# EAGLE design Klasmata (EAGLE 9.6.2)
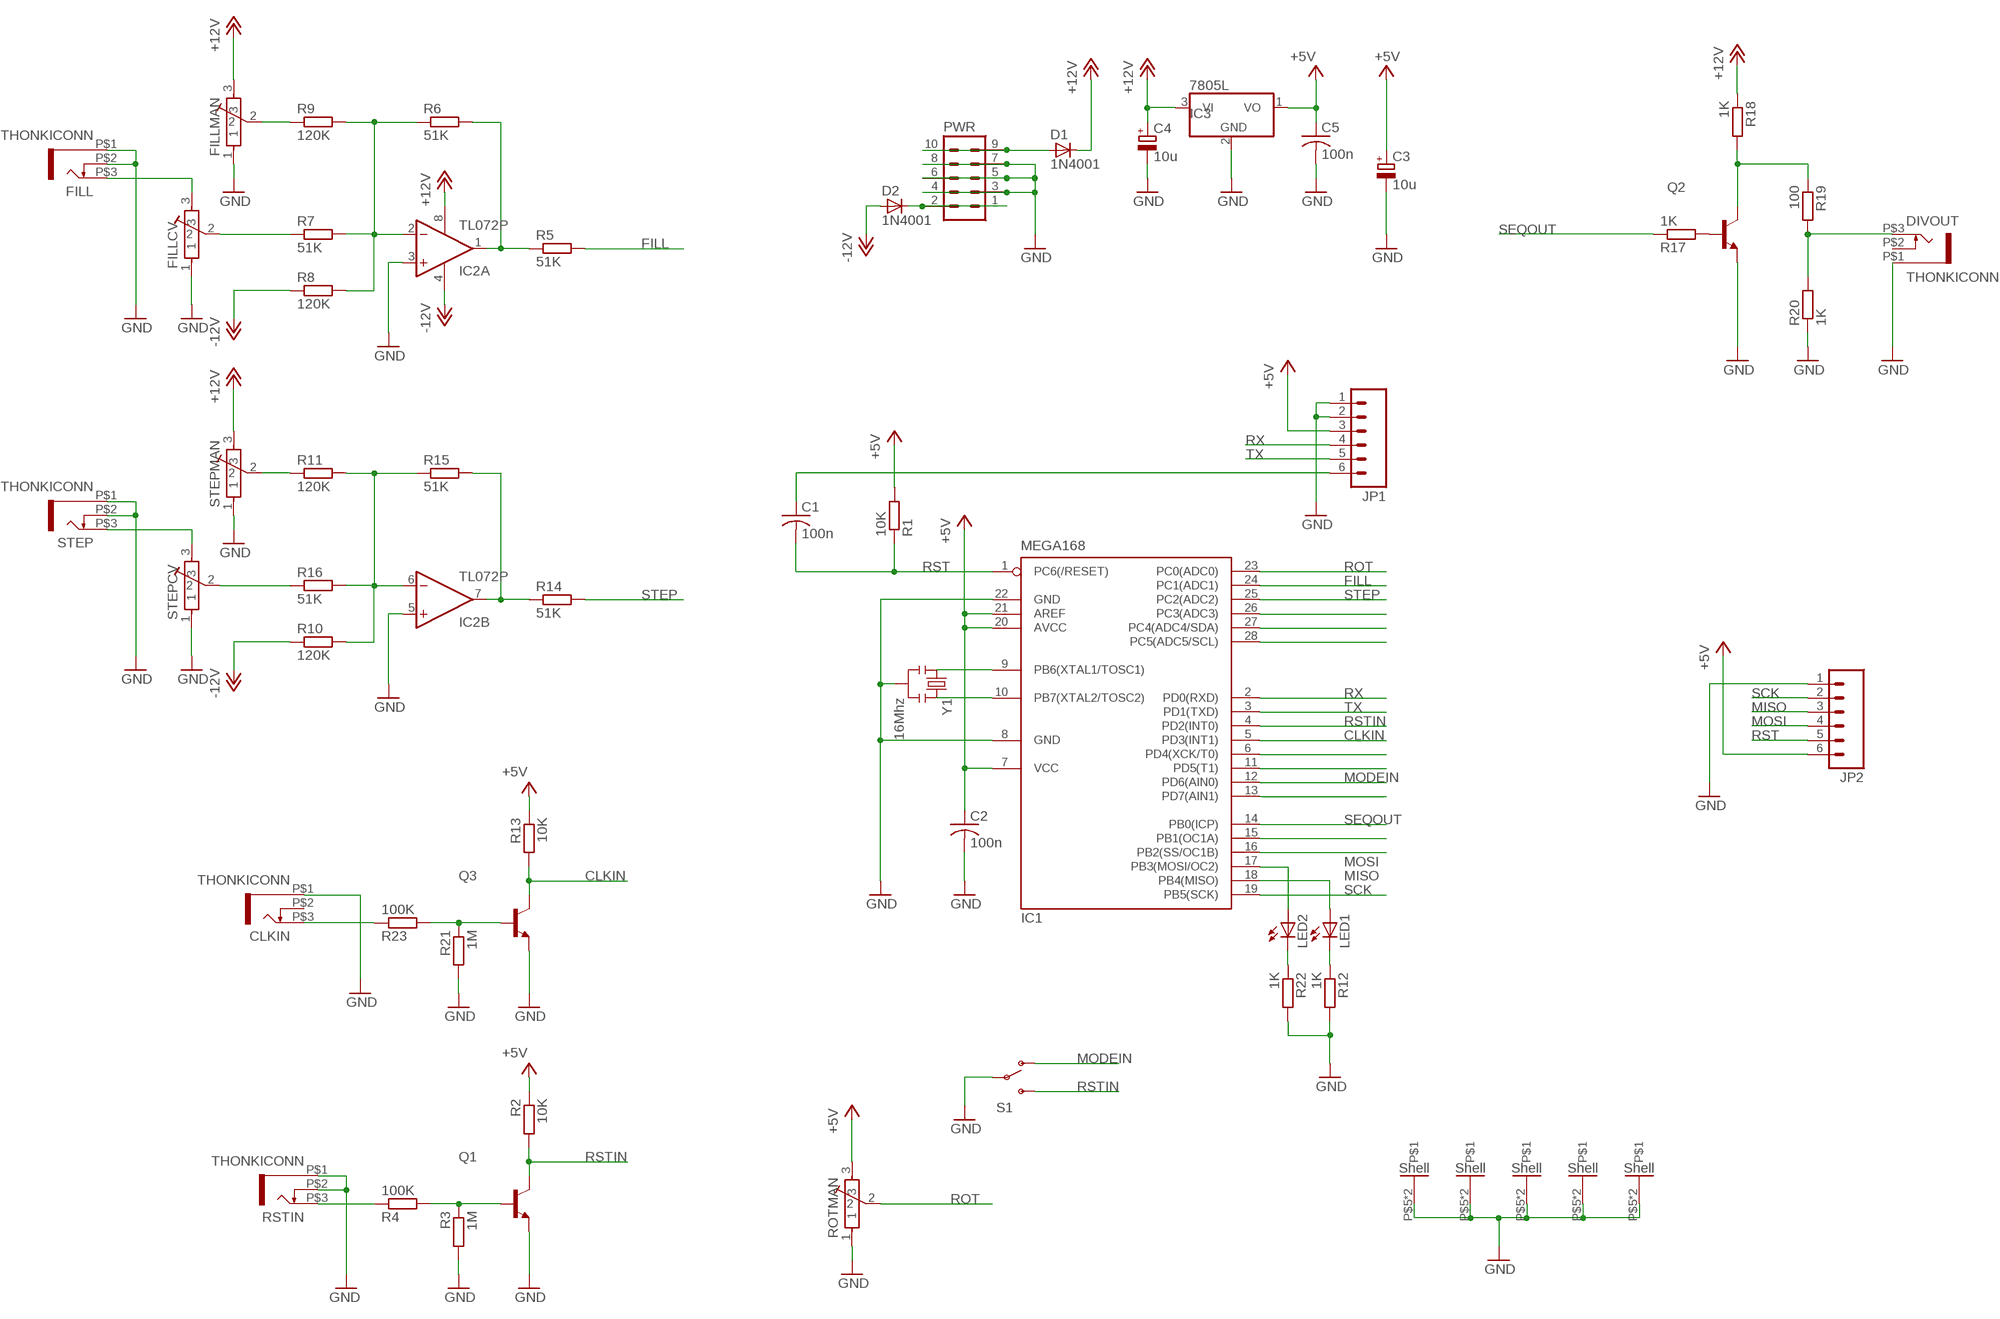
[diagram p0: schematic, sheet 1]

## Parts
C1  100n  C-US050-024X044  [C050-024X044]
C2  100n  C-US050-024X044  [C050-024X044]
C3  10u  CPOL-EUE2.5-6  [E2,5-6]
C4  10u  CPOL-EUE5-6  [E5-6]
C5  100n  C-US050-024X044  [C050-024X044]
CLKIN  THONKICONN  [THONKICONN]
D1  1N4001  DIODE1N4001  [DIODE-1N4001]
D2  1N4001  DIODE1N4001  [DIODE-1N4001]
DIVOUT  THONKICONN  [THONKICONN]
FILL  THONKICONN  [THONKICONN]
FILLCV  POT-ALPS-RK09L1140  [POT-ALPS-RK09L1140]
FILLMAN  POT-ALPS-RK09L1140  [POT-ALPS-RK09L1140]
IC1  MEGA168  MEGA8-P  [DIL28-3]
IC2  TL072P  [DIL08]
IC3  7805L  [TO92]
JP1  M06SIP  [1X06]
JP2  M06SIP  [1X06]
LED1  LED3MM  [LED3MM]
LED2  LED3MM  [LED3MM]
PWR  MA05-2  [MA05-2]
Q1  2N3904-NPN-TO92-EBC  [TO92-EBC]
Q2  2N3904-NPN-TO92-EBC  [TO92-EBC]
Q3  2N3904-NPN-TO92-EBC  [TO92-EBC]
R1  10K  R-EU_0204/7  [0204/7]
R2  10K  R-EU_0204/7  [0204/7]
R3  1M  R-EU_0204/7  [0204/7]
R4  100K  R-EU_0204/7  [0204/7]
R5  51K  R-EU_0204/7  [0204/7]
R6  51K  R-EU_0204/7  [0204/7]
R7  51K  R-EU_0204/7  [0204/7]
R8  120K  R-EU_0204/7  [0204/7]
R9  120K  R-EU_0204/7  [0204/7]
R10  120K  R-EU_0204/7  [0204/7]
R11  120K  R-EU_0204/7  [0204/7]
R12  1K  R-EU_0204/7  [0204/7]
R13  10K  R-EU_0204/7  [0204/7]
R14  51K  R-EU_0204/7  [0204/7]
R15  51K  R-EU_0204/7  [0204/7]
R16  51K  R-EU_0204/7  [0204/7]
R17  1K  R-EU_0204/7  [0204/7]
R18  1K  R-EU_0204/7  [0204/7]
R19  100  R-EU_0204/7  [0204/7]
R20  1K  R-EU_0204/7  [0204/7]
R21  1M  R-EU_0204/7  [0204/7]
R22  1K  R-EU_0204/7  [0204/7]
R23  100K  R-EU_0204/7  [0204/7]
ROTMAN  POT-ALPS-RK09L1140  [POT-ALPS-RK09L1140]
RSTIN  THONKICONN  [THONKICONN]
S1  SWITCH-SPST  [SWITCH-SPDT-SALECOM-T8014]
STEP  THONKICONN  [THONKICONN]
STEPCV  POT-ALPS-RK09L1140  [POT-ALPS-RK09L1140]
STEPMAN  POT-ALPS-RK09L1140  [POT-ALPS-RK09L1140]
Y1  16Mhz  RESONATORPTH  [RESONATOR-PTH]

## Nets
+5V: C2.1 C3.+ C5.1 IC1.7(VCC) IC1.20(AVCC) IC1.21(AREF) IC3.1(VO) JP1.3 JP2.6 R1.2 R2.1 R13.1 ROTMAN.3
+12V: C4.+ D1.C FILLMAN.3 IC2.8(P:V+) IC3.3(VI) R18.1 STEPMAN.3
-12V: D2.A IC2.4(P:V-) R8.1 R10.1
ALT: IC1.11(PD5(T1))
CLKIN: IC1.5(PD3(INT1)) Q3.C R13.2
CMBOUT: IC1.16(PB2(SS/OC1B))
DELOUT: IC1.15(PB1(OC1A))
FILL: IC1.24(PC1(ADC1)) R5.2
GND: C2.2 C3.- C4.- C5.2 CLKIN.P$1 DIVOUT.P$1 FILL.P$1 FILL.P$2 FILLCV.1 FILLCV.P$5 FILLCV.P$6 FILLMAN.1 FILLMAN.P$5 FILLMAN.P$6 IC1.8(GND) IC1.22(GND) IC2.3(A:+IN) IC2.5(B:+IN) IC3.2(GND) JP1.1 JP1.2 JP2.1 PWR.3 PWR.4 PWR.5 PWR.6 PWR.7 PWR.8 Q1.E Q2.E Q3.E R3.2 R12.2 R20.1 R21.2 R22.2 ROTMAN.1 ROTMAN.P$5 ROTMAN.P$6 RSTIN.P$1 RSTIN.P$2 S1.2(P) STEP.P$1 STEP.P$2 STEPCV.1 STEPCV.P$5 STEPCV.P$6 STEPMAN.1 STEPMAN.P$5 STEPMAN.P$6 Y1.2
MISO: IC1.18(PB4(MISO)) JP2.3 LED1.A
MODEB: IC1.13(PD7(AIN1))
MODEIN: IC1.12(PD6(AIN0)) S1.1(O)
MOSI: IC1.17(PB3(MOSI/OC2)) JP2.4 LED2.A
N$1: FILL.P$3 FILLCV.3
N$2: IC2.2(A:-IN) R6.1 R7.2 R8.2 R9.2
N$3: FILLMAN.2 R9.1
N$4: IC2.1(A:OUT) R5.1 R6.2
N$5: FILLCV.2 R7.1
N$6: D1.A PWR.9 PWR.10
N$7: IC2.6(B:-IN) R10.2 R11.2 R15.1 R16.2
N$8: R11.1 STEPMAN.2
N$9: IC2.7(B:OUT) R14.1 R15.2
N$10: R16.1 STEPCV.2
N$12: STEP.P$3 STEPCV.3
N$15: IC1.26(PC3(ADC3))
N$16: IC1.27(PC4(ADC4/SDA))
N$17: IC1.28(PC5(ADC5/SCL))
N$20: IC1.9(PB6(XTAL1/TOSC1)) Y1.1
N$21: IC1.10(PB7(XTAL2/TOSC2)) Y1.3
N$23: LED2.K(C) R22.1
N$24: LED1.K(C) R12.1
N$27: Q3.B R21.1 R23.2
N$28: CLKIN.P$3 R23.1
N$29: C1.1 JP1.6
N$31: Q1.B R3.1 R4.2
N$33: Q2.B R17.2
N$36: DIVOUT.P$3 R19.2 R20.2
N$37: Q2.C R18.2 R19.1
N$40: R4.1 RSTIN.P$3
N$42: D2.C PWR.1 PWR.2
ROT: IC1.23(PC0(ADC0)) ROTMAN.2
RST: C1.2 IC1.1(PC6(/RESET)) JP2.5 R1.1
RSTIN: IC1.4(PD2(INT0)) Q1.C R2.2 S1.3(S)
RX: IC1.2(PD0(RXD)) JP1.4
SCK: IC1.19(PB5(SCK)) JP2.2
SEQOUT: IC1.14(PB0(ICP)) R17.1
STEP: IC1.25(PC2(ADC2)) R14.2
TRIG: IC1.6(PD4(XCK/T0))
TX: IC1.3(PD1(TXD)) JP1.5
Unconnected: CLKIN.P$2 DIVOUT.P$2

## Library data of the parts
C1 C2 C5 = rcl:C-US: CAPACITOR, American symbol
C3 = resistor:CPOL-EU: POLARIZED CAPACITOR, European symbol
C4 = rcl:CPOL-EU: POLARIZED CAPACITOR, European symbol
CLKIN DIVOUT FILL RSTIN STEP = Rebel:THONKICONN
D1 D2 = Rebel:DIODE: Diode
FILLCV FILLMAN ROTMAN STEPCV STEPMAN = Rebel:POT-ALPS-RK09L
IC1 = atmel:MEGA8-P: MICROCONTROLLER 8 Kbytes FLASH, 1 kbytes SRAM, 512 bytes EEPROM, USART, 4-channel 10 bit ADC, 2-channel 8 bit ADC Pin compatible with Atmega48, ATMega88, ATMega168 Source: avr.lbr; OC_FARNELL: unknown; OC_NEWARK: unknown
IC2 = linear:TL072: OP AMP
IC3 = linear:78*: Positive VOLTAGE REGULATOR Source: http://cache.national.com/ds/LM/LM78L05.pdf http://www.fairchildsemi.com/ds/LM/LM7805.pdf
JP1 JP2 = SparkFun:M06: Header 6 Standard 6-pin 0.1" header. Use with straight break away headers (SKU : PRT-00116), right angle break away headers (PRT-00553), swiss pins (PRT-00743), machine pins (PRT-00117), and female headers (PRT-00115). Molex polarized connector foot print use with SKU : PRT-08094 with associated crimp pins and housings. NOTES ON THE VARIANTS LOCK and LOCK_LONGPADS... This footprint was designed to help hold the alignment of a through-hole component (i.e. 6-pin header) while soldering it into place. You may notice that each hole has been shifted either up or down by 0.005 of an inch from it's more standard position (which is a perfectly straight line). This slight alteration caused the pins (the squares in the middle) to touch the edges of the holes. Because they are alternating, it causes a "brace" to hold the component in place. 0.005 has proven to be the perfect amount of "off-center" position when using our standard breakaway headers. Although looks a little odd when you look at the bare footprint, once you have a header in there, the alteration is very hard to notice. Also, if you push a header all the way into place, it is covered up entirely on the bottom side. This idea of altering the position of holes to aid alignment will be further integrated into the Sparkfun Library for other footprints. It can help hold any component with 3 or more connection pins.
LED1 LED2 = Rebel:LED: LED OSRAM: - CHIPLED LG R971, LG N971, LY N971, LG Q971, LY Q971, LO R971, LY R971 LH N974, LH R974 LS Q976, LO Q976, LY Q976 LO Q996 - Hyper CHIPLED LW Q18S LB Q993, LB Q99A, LB R99A - SideLED LS A670, LO A670, LY A670, LG A670, LP A670 LB A673, LV A673, LT A673, LW A673 LH A674 LY A675 LS A676, LA A676, LO A676, LY A676, LW A676 LS A679, LY A679, LG A679 - Hyper Micro SIDELED® LS Y876, LA Y876, LO Y876, LY Y876 LT Y87S - SmartLED LW L88C, LW L88S LB L89C, LB L89S, LG L890 LS L89K, LO L89K, LY L89K LS L896, LA L896, LO L896, LY L896 - TOPLED LS T670, LO T670, LY T670, LG T670, LP T670 LSG T670, LSP T670, LSY T670, LOP T670, LYG T670 LG T671, LOG T671, LSG T671 LB T673, LV T673, LT T673, LW T673 LH T674 LS T676, LA T676, LO T676, LY T676, LB T676, LH T676, LSB T676, LW T676 LB T67C, LV T67C, LT T67C, LS T67K, LO T67K, LY T67K, LW E67C LS E67B, LA E67B, LO E67B, LY E67B, LB E67C, LV E67C, LT E67C LW T67C LS T679, LY T679, LG T679 LS T770, LO T770, LY T770, LG T770, LP T770 LB T773, LV T773, LT T773, LW T773 LH T774 LS E675, LA E675, LY E675, LS T675 LS T776, LA T776, LO T776, LY T776, LB T776 LHGB T686 LT T68C, LB T68C - Hyper Mini TOPLED® LB M676 - Mini TOPLED Santana® LG M470 LS M47K, LO M47K, LY M47K Source: http://www.osram.convergy.de LUXEON: - LUMILED® LXK2-PW12-R00, LXK2-PW12-S00, LXK2-PW14-U00, LXK2-PW14-V00 LXK2-PM12-R00, LXK2-PM12-S00, LXK2-PM14-U00 LXK2-PE12-Q00, LXK2-PE12-R00, LXK2-PE12-S00, LXK2-PE14-T00, LXK2-PE14-U00 LXK2-PB12-K00, LXK2-PB12-L00, LXK2-PB12-M00, LXK2-PB14-N00, LXK2-PB14-P00, LXK2-PB14-Q00 LXK2-PR12-L00, LXK2-PR12-M00, LXK2-PR14-Q00, LXK2-PR14-R00 LXK2-PD12-Q00, LXK2-PD12-R00, LXK2-PD12-S00 LXK2-PH12-R00, LXK2-PH12-S00 LXK2-PL12-P00, LXK2-PL12-Q00, LXK2-PL12-R00 Source: www.luxeon.com KINGBRIGHT: KA-3528ASYC Source: www.kingbright.com
PWR = Rebel:MA05-2: PIN HEADER; OC_FARNELL: unknown; OC_NEWARK: unknown
Q1-Q3 = transistor-neu-to92:*-NPN-: NPN Transistror
R1-R23 = Rebel:R-EU_: RESISTOR, European symbol
S1 = Rebel:SWITCH-SPST: SPST Switch Simple slide switch. Spark Fun Electronics SKU : COM-00102
Y1 = SparkFun:RESONATOR: Resonator Small SMD resonator. This is the itty bitty 10/20MHz resonators with built in caps. CSTCE10M0G55 and CSTCE20M0V53. Footprint has been reviewed closely but hasn't been tested yet.

## Board
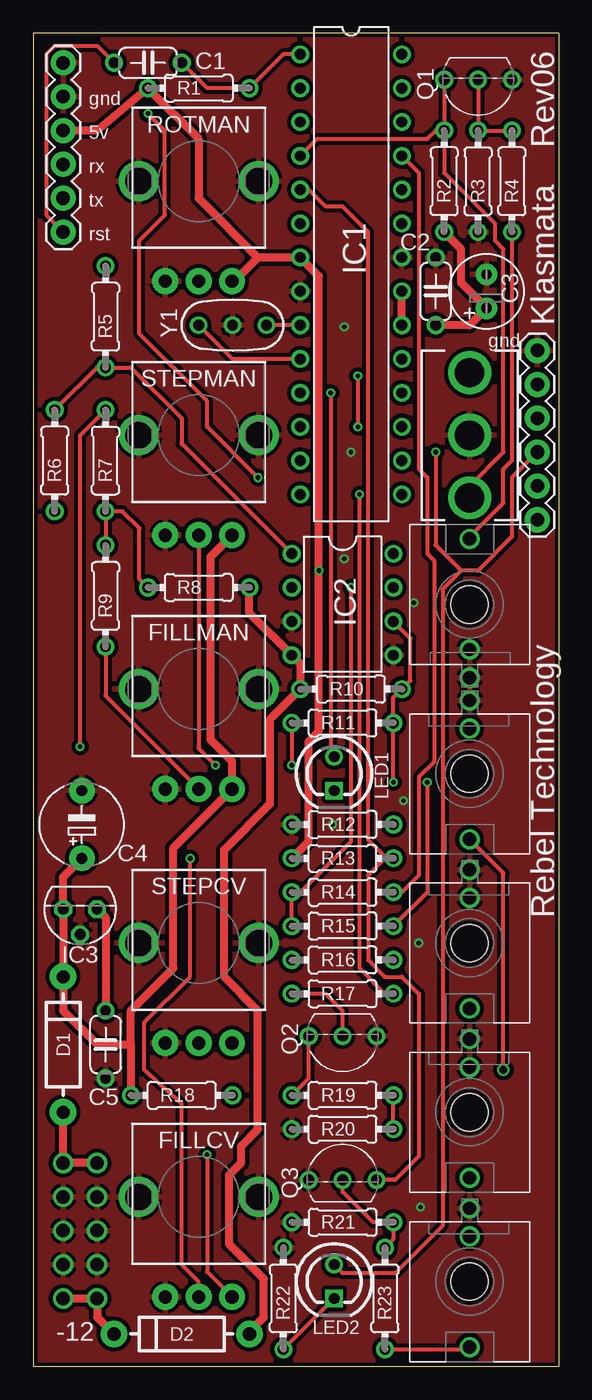
[diagram p1: board, top side]
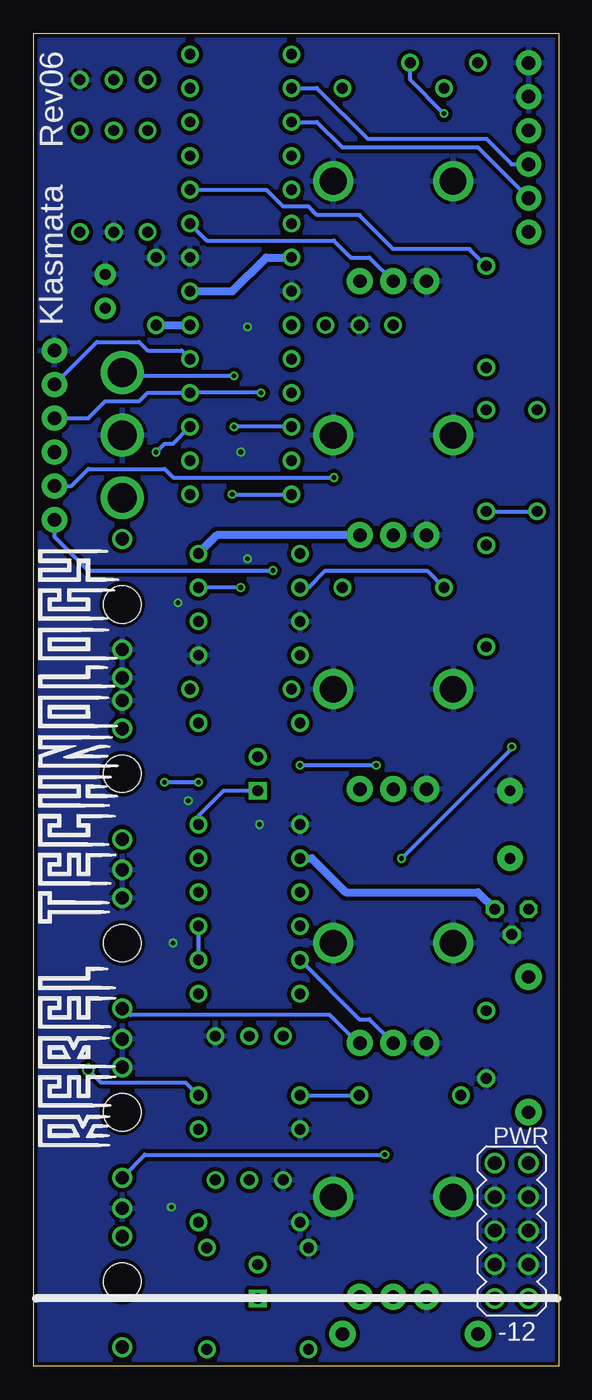
[diagram p2: board, bottom side, seen from below]

Size 39.39 x 100 mm. Coordinates in mm from the lower left corner, seen from the top.
Outline: 39.39,100 0,100 0,0 39.39,0 39.39,100
Copper layers (1*16): Top 0.035mm / dielectric 1.5mm / Bottom 0.035mm
Design rules "Fusion_eagle_rule_v1.1": minimum track width 6mil, minimum drill 12mil, track to track 6mil, track to pad 6mil, pad to pad 6mil, via to via 6mil, smd to smd 0mil, copper to edge 10mil, drill to drill 10mil, minimum pad ring 10mil, minimum via ring 6mil, stop-mask expansion 2mil, vias tented up to drill 100mil, thermal gap 10mil

### Footprints (pad centres in the part's own frame; a part is rotated, then mirrored left to right if it is on the bottom)
C050-024X044 = drill 0.813: 1 -2.54,0; 2 2.54,0
E2,5-6 = drill 0.813 pad 1.6: + -1.27,0; - 1.27,0
E5-6 = drill 0.813 pad 1.905: + -2.54,0; - 2.54,0
THONKICONN = drill 1: P$1 0,-5.5; P$2 0,-3.38; P$3 0,4.92 | hole 2.8: 0,0
DIODE-1N4001 = drill 1 pad 1.981: A -5.08,0; C 5.08,0
POT-ALPS-RK09L1140 = drill 1 pad 1.93: 1 -2.5,-7.5; 2 0,-7.5; 3 2.5,-7.5 | drill 2: P$5 -4.5,0; P$6 4.5,0
DIL28-3 = drill 0.813: 1 -16.51,-3.81; 2 -13.97,-3.81; 3 -11.43,-3.81; 4 -8.89,-3.81; 5 -6.35,-3.81; 6 -3.81,-3.81; 7 -1.27,-3.81; 8 1.27,-3.81; 9 3.81,-3.81; 10 6.35,-3.81; 11 8.89,-3.81; 12 11.43,-3.81; 13 13.97,-3.81; 14 16.51,-3.81; 15 16.51,3.81; 16 13.97,3.81; 17 11.43,3.81; 18 8.89,3.81; 19 6.35,3.81; 20 3.81,3.81; 21 1.27,3.81; 22 -1.27,3.81; 23 -3.81,3.81; 24 -6.35,3.81; 25 -8.89,3.81; 26 -11.43,3.81; 27 -13.97,3.81; 28 -16.51,3.81
DIL08 = drill 0.813 pad 1.27: 1 -3.81,-3.81; 2 -1.27,-3.81; 3 1.27,-3.81; 4 3.81,-3.81; 5 3.81,3.81; 6 1.27,3.81; 7 -1.27,3.81; 8 -3.81,3.81
TO92 = drill 0.813 octagon: 1 -1.27,0; 2 0,1.905; 3 1.27,0
1X06 = drill 1.016 pad 1.88: 1 0,0; 2 2.54,0; 3 5.08,0; 4 7.62,0; 5 10.16,0; 6 12.7,0
LED3MM = drill 0.813: A -1.27,0 | drill 0.813 square: K 1.27,0
MA05-2 = drill 1.016: 1 -5.08,-1.27; 2 -5.08,1.27; 3 -2.54,-1.27; 4 -2.54,1.27; 5 0,-1.27; 6 0,1.27; 7 2.54,-1.27; 8 2.54,1.27; 9 5.08,-1.27; 10 5.08,1.27
TO92-EBC = drill 0.813: B 0,-1.27; C 2.54,-1.27; E -2.54,-1.27
0204/7 = drill 0.813: 1 -3.81,0; 2 3.81,0
SWITCH-SPDT-SALECOM-T8014 = drill 2.2: 1 0,4.699; 2 0,0; 3 0,-4.699
RESONATOR-PTH = drill 0.8: 1 -2.54,0; 2 0,0; 3 2.54,0

### Placement (x,y rotation side)
C1  8.59,97.79 0 top
C2  30.18,80.64 90 top
C3  33.99,80.64 90 top
C4  3.64,40.64 90 top
C5  5.42,24.13 270 top
CLKIN  32.72,6.35 180 top
D1  2.24,24.13 90 top
D2  11.13,2.41 180 top
DIVOUT  32.72,44.45 180 top
FILL  32.72,19.05 180 top
FILLCV  12.4,12.7 0 top
FILLMAN  12.4,50.8 0 top
IC1  23.83,81.92 270 top
IC2  23.2,57.15 270 top
IC3  3.51,34.29 180 top
JP1  2.24,97.79 270 top
JP2  37.8,76.2 270 top
LED1  22.56,44.45 270 top
LED2  22.56,6.35 270 top
PWR  3.51,10.16 90 bottom
Q1  33.36,95.25 180 top
Q2  23.2,23.5 180 top
Q3  23.2,15.24 0 top
R1  12.4,95.89 180 top
R2  30.81,88.9 90 top
R3  33.36,88.9 270 top
R4  35.9,88.9 90 top
R5  5.42,78.74 90 top
R6  1.6,67.94 90 top
R7  5.42,67.94 270 top
R8  12.4,58.42 180 top
R9  5.42,57.78 90 top
R10  23.83,50.8 0 top
R11  23.2,48.26 0 top
R12  23.2,40.64 180 top
R13  23.2,38.1 0 top
R14  23.2,35.56 0 top
R15  23.2,33.02 180 top
R16  23.2,30.48 0 top
R17  23.2,27.94 180 top
R18  11.13,20.32 0 top
R19  23.2,20.32 0 top
R20  23.2,17.78 0 top
R21  23.2,10.79 180 top
R22  18.75,5.08 90 top
R23  26.37,5.08 90 top
ROTMAN  12.4,88.9 0 top
RSTIN  32.72,57.15 0 top
S1  32.72,69.85 0 top
STEP  32.72,31.75 180 top
STEPCV  12.4,31.75 0 top
STEPMAN  12.4,69.85 0 top
Y1  14.94,78.11 180 top

### Tracks (layer width: path | path; a pad name or v marks a point on that pad's centre or on a via)
+5V  (via drill 0.35)
  Top 0.61: IC1.20 IC1.21 | C2.1 32.72,78.11 C3.+ 32.09,81.28 32.09,83.82 R2.1 | JP1.3 4.78,92.71 R1.2 12.4,92.08 12.4,87.63 16.84,83.19 | 16.84,83.19 IC1.7 21.42,81.79 v21.42,59.69 21.42,47.62 20.65,46.86 20.65,39.37 R13.1 | ROTMAN.3 15.06,81.4 16.84,83.19 | C5.1 5.42,33.66 IC3.1
  Bottom 0.305: JP2.6 37.8,62.23 35.26,59.69 v21.42,59.69
  Bottom 0.61: C2.1 IC1.20 | IC1.21 24.46,80.64 21.93,83.19 IC1.7 | R13.1 18.5,38.1 15.96,35.56 6.05,35.56 IC3.1
+12V
  Top 0.61: STEPMAN.3 13.29,60.74 13.29,46.99 14.9,45.38 FILLMAN.3 10.49,38.9 10.49,29.84 7.32,26.67 7.32,24.13 | C4.+ 2.24,36.7 IC3.3 D1.C 2.24,26.67 4.78,24.13 7.32,24.13 | 7.32,24.13 R18.1
  Bottom 0.61: STEPMAN.3 25.61,62.35 IC2.8
-12V
  Top 0.61: R8.1 16.21,56.52 IC2.4 20.02,52.7 R10.1 17.73,48.51 17.73,42.16 14.3,38.73 14.3,29.21 16.84,26.67 16.84,17.78 15.57,16.51 15.57,15.24 14.69,14.35 14.69,9.14 17.29,6.54 17.29,3.68 16.21,2.6 D2.A
CLKIN
  Top 0.305: IC1.5 20.65,88.27 21.93,87 23.2,87 25.1,85.09 25.1,39.5 26.5,38.1 R13.2 26.37,38.1 25.1,36.83 25.1,30.48 26.37,29.21 27.64,29.21 28.91,27.94 28.91,15.75 27.13,13.97 Q3.C
FILL
  Bottom 0.305: IC1.24 21.93,88.27 20.65,87 18.75,87 18.11,86.36 14.94,86.36 12.4,83.82 6.69,83.82 R5.2
GND  (via drill 0.35)
  other vias: 23.83,68.58 23.32,77.98 28.91,31.75 29.04,11.94 28.53,57.28 23.32,60.58 27.77,42.42 22.43,40.64
  pour Bottom (isolate 0.305): 40.34,0 -0.3,0 -0.3,100.33 40.34,100.33
  pour Top (isolate 0.305): 40.34,0 -1.57,0 -1.57,100.33 40.34,100.33
MISO  (via drill 0.35)
  Top 0.305: v22.31,73.03 22.31,45.97 LED1.A
  Bottom 0.305: v22.31,73.03 IC1.18 30.81,73.03 31.45,72.39 33.99,72.39 35.26,71.12 JP2.3
MODEIN  (via drill 0.35)
  Top 0.305: v24.34,74.3 v24.34,70.48
  Bottom 0.305: IC1.12 v24.34,70.48 | v24.34,74.3 32.47,74.3 S1.1
MOSI  (via drill 0.35)
  Top 0.305: LED2.A 23.2,6.99 27.13,6.99 30.69,10.54 30.69,58.29 32.09,59.69 | JP2.4 35.9,66.67 35.9,62.23 33.36,59.69 32.09,59.69 | v30.18,68.58 30.18,61.59 32.09,59.69
  Bottom 0.305: v30.18,68.58 29.54,69.22 28.91,69.22 IC1.17
N$1  (via drill 0.35 pad 0.61)
  Top 0.305: v13.04,15.88 13.04,7.07 FILLCV.3
  Bottom 0.305: FILL.P$3 31.04,15.88 v13.04,15.88
N$2
  Top 0.305: R9.2 R7.2 6.69,64.14 7.96,62.87 7.96,59.05 R8.2
  Bottom 0.305: R7.2 R6.1 | IC2.2 18.75,58.42 17.48,59.69 9.86,59.69 R8.2
N$3
  Top 0.305: R9.1 5.42,50.28 FILLMAN.2
N$4
  Top 0.305: R6.2 4.78,74.93 R5.1 7.32,74.93 11.13,71.12 11.13,69.22 IC2.1
N$5  (via drill 0.35 pad 0.61)
  Top 0.305: v3.51,46.48 3.51,69.85 R7.1 | v11.76,38.1 11.76,29.21 8.34,25.78 8.34,22.23 11.13,19.68 11.13,7.62 12.4,6.35 FILLCV.2
  Bottom 0.305: v11.76,38.1 3.45,46.42 v3.51,46.48
N$6
  Top 0.61: PWR.10 PWR.9 D1.A
N$7  (via drill 0.35)
  Top 0.305: IC2.6 28.27,54.61 28.27,51.44 R10.2 27,50.16 R11.2 v27,43.81 | v29.54,43.81 29.54,35.56 R15.1
  Bottom 0.305: v29.54,43.81 v27,43.81 | R15.1 R16.2
N$8  (via drill 0.35, 0.35 pad 0.61)
  Top 0.305: STEPMAN.2 12.4,46.35 v13.67,45.09 | R11.1 v19.38,45.09
  Bottom 0.305: v13.67,45.09 v19.38,45.09
N$9  (via drill 0.35)
  Top 0.305: R15.2 R14.1 20.02,35.56 23.83,39.37 v23.83,58.42
  Bottom 0.305: v23.83,58.42 IC2.7
N$10
  Bottom 0.305: R16.1 14.94,26.04 14.18,26.04 STEPCV.2
N$12
  Bottom 0.305: STEPCV.3 14.94,24.29 15.1,24.29 17.16,26.35 32.09,26.35 32.56,26.83 STEP.P$3
N$20
  Top 0.305: IC1.9 Y1.1
N$21
  Top 0.305: IC1.10 14.94,75.56 Y1.3
N$23
  Top 0.305: R22.1 LED2.K
N$24
  Bottom 0.305: LED1.K 25.1,43.18 27,41.27 R12.1
N$27
  Top 0.305: R23.2 27,9.53 R21.1 25.48,10.79 23.2,13.08 Q3.B
N$28
  Top 0.305: R23.1 32.25,1.27 CLKIN.P$3
N$29
  Top 0.305: JP1.6 0.97,86.36 0.97,98.42 1.6,99.06 4.78,99.06 C1.1
N$31
  Top 0.305: Q1.B R3.1 R4.2
N$33
  Top 0.305: Q2.B 23.2,26.67 21.93,27.94 R17.2
N$36  (via drill 0.6)
  Top 0.305: R20.2 R19.2 | v35.26,22.23 35.26,36.99 DIVOUT.P$3
  Bottom 0.305: R19.2 27.96,21.27 34.31,21.27 v35.26,22.23
N$37
  Top 0.305: R19.1 20.65,21.59 Q2.C
  Bottom 0.305: R19.1 R18.2
N$40
  Top 0.305: R4.1 35.9,67.94 35.26,67.31 35.26,64.77 32.72,62.23 RSTIN.P$3
N$42
  Top 0.61: PWR.1 PWR.2 4.78,3.68 D2.C
ROT
  Bottom 0.305: IC1.23 26.37,84.45 16.84,84.45 15.57,83.19 14.18,83.19 ROTMAN.2
RST  (via drill 0.35)
  Top 0.305: C1.2 13.04,95.89 R1.1 18.75,98.42 IC1.1 | v16.84,66.67 13.04,70.48 13.04,72.39 7.96,77.47 7.96,84.45 9.86,86.36 9.86,92.71 v8.59,93.98
  Bottom 0.305: JP2.5 36.53,66.04 35.26,67.31 29.54,67.31 28.91,66.67 v16.84,66.67 | v8.59,93.98 11.13,96.52 C1.2
RSTIN
  Top 0.305: Q1.C R2.2 | IC1.4 21.29,92.08 29.54,92.08 30.18,92.71 R2.2 | R2.2 30.81,89.53 34.62,85.72 34.62,84.45 35.26,83.82 35.26,68.58 32.72,66.04 S1.3
RX
  Bottom 0.305: IC1.2 18.11,95.89 14.3,92.08 5.42,92.08 3.51,90.17 JP1.4
SCK
  Bottom 0.305: JP2.2 34.62,76.83 31.45,76.83 30.81,76.2 28.27,76.2 IC1.19
SEQOUT  (via drill 0.35)
  Top 0.305: v24.46,65.41 24.46,29.84 26.37,27.94 R17.1
  Bottom 0.305: v24.46,65.41 IC1.14
STEP
  Top 0.305: IC1.25 28.91,89.53 28.91,67.31 29.54,66.67 29.54,60.96 30.05,60.45 30.05,45.34 28.91,44.2 28.91,36.83 27.64,35.56 R14.2
TX
  Bottom 0.305: IC1.3 18.11,93.34 16.21,91.44 6.05,91.44 JP1.5

### Text on the board
tPlace: gnd | 5v | Rev06 | rx | tx | rst | Klasmata | gnd | Rebel Technology | -12
bPlace: Rev06 | Klasmata | -12
tNames: Y1